# EAGLE design object_1 (EAGLE 9.0.0)
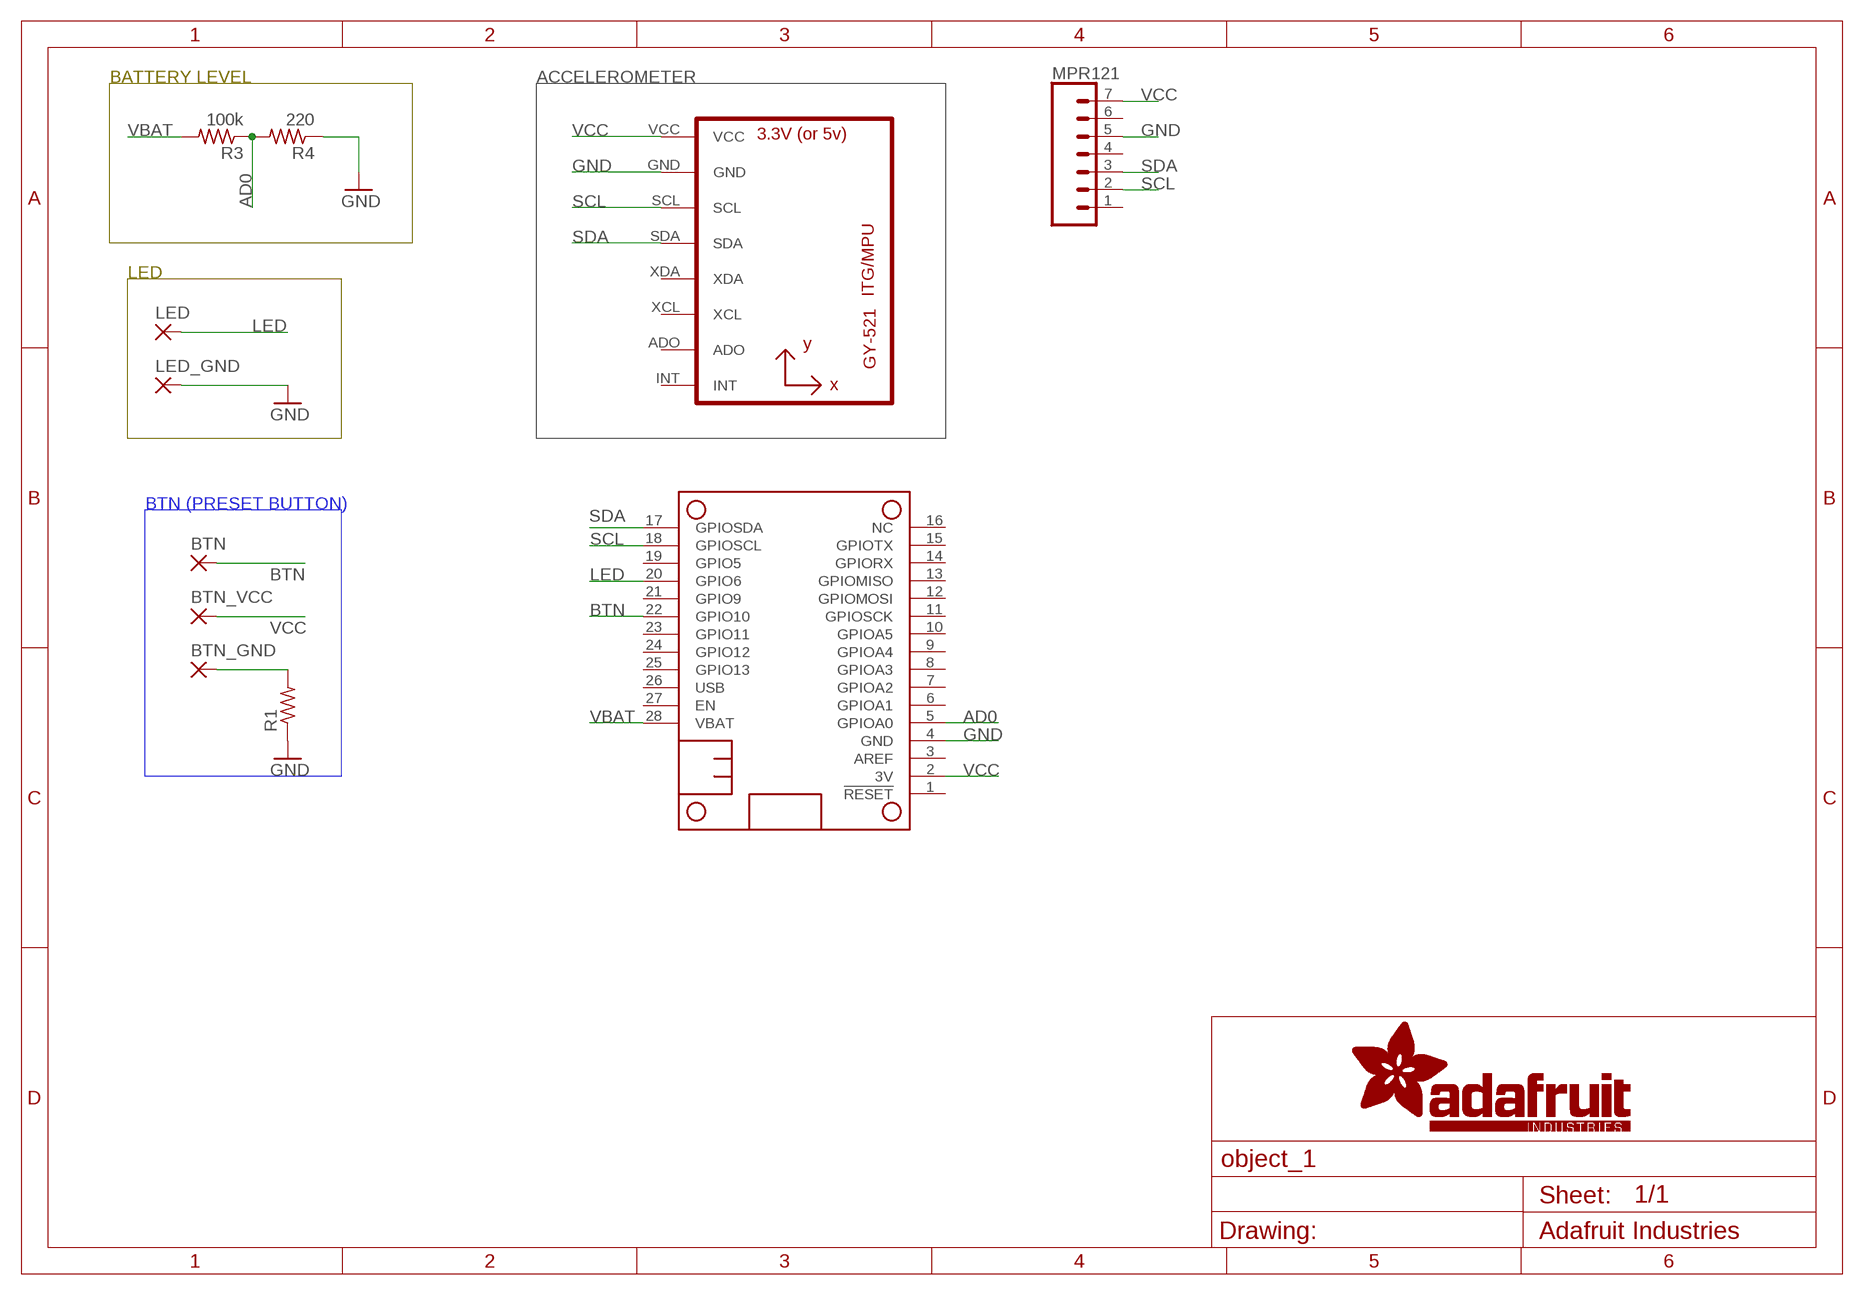
[diagram p0: schematic, sheet 1]

## Parts
BTN  2,15/1,0  [2,15/1,0]
BTN_GND  2,15/1,0  [2,15/1,0]
BTN_VCC  2,15/1,0  [2,15/1,0]
LED  2,15/1,0  [2,15/1,0]
LED_GND  2,15/1,0  [2,15/1,0]
MPR121  CONN_07NO_SILK  [1X07_NO_SILK]
MS1  FEATHERWING  [FEATHERWING]
R1  R-US_0204/5  [0204/5]
R3  100k  R-US_0204/5  [0204/5]
R4  220  R-US_0204/5  [0204/5]
U1  GY-521MPU6050  [GY-521]

## Nets
AD0: MS1.5(GPIOA0) R3.1 R4.2
BTN: BTN.1(P) MS1.22(GPIO10)
GND: LED_GND.1(P) MPR121.5 MS1.4(GND) R1.1 R4.1 U1.GND
GND_BTN: BTN_GND.1(P) R1.2
LED: LED.1(P) MS1.20(GPIO6)
SCL: MPR121.2 MS1.18(GPIOSCL) U1.SCL
SDA: MPR121.3 MS1.17(GPIOSDA) U1.SDA
VBAT: MS1.28(VBAT) R3.2
VCC: BTN_VCC.1(P) MPR121.7 MS1.2(3V) U1.VCC
Unconnected: MPR121.1 MPR121.4 MPR121.6 MS1.1(!RESET) MS1.3(AREF) MS1.6(GPIOA1) MS1.7(GPIOA2) MS1.8(GPIOA3) MS1.9(GPIOA4) MS1.10(GPIOA5) MS1.11(GPIOSCK) MS1.12(GPIOMOSI) MS1.13(GPIOMISO) MS1.14(GPIORX) MS1.15(GPIOTX) MS1.16(NC) MS1.19(GPIO5) MS1.21(GPIO9) MS1.23(GPIO11) MS1.24(GPIO12) MS1.25(GPIO13) MS1.26(USB) MS1.27(EN) U1.ADO U1.INT U1.XCL U1.XDA

## Notes on the sheet
- BATTERY LEVEL | ACCELEROMETER
- LED
- BTN (PRESET BUTTON)

## Library data of the parts
BTN BTN_GND BTN_VCC LED LED_GND = wirepad:2,15/1,0: THROUGH-HOLE PAD
MPR121 = SparkFun-Connectors:CONN_07: Multi connection point. Often used as Generic Header-pin footprint for 0.1 inch spaced/style header connections On any of the 0.1 inch spaced packages, you can populate with these: Break Away Headers - Straight <https://www.sparkfun.com/products/116> (PRT-00116) Break Away Male Headers - Right Angle <https://www.sparkfun.com/products/553> (PRT-00553) Female Headers <https://www.sparkfun.com/products/115> (PRT-00115) Break Away Headers - Machine Pin <https://www.sparkfun.com/products/117> (PRT-00117) Break Away Female Headers - Swiss Machine Pin <https://www.sparkfun.com/products/743> (PRT-00743) For SCREWTERMINALS and SPRING TERMINALS visit here: Screw Terimnals on SparkFun.com <https://www.sparkfun.com/search/results?term=Screw+Terminals> (5mm/3.5mm/2.54mm spacing) This device is also useful as a general connection point to wire up your design to another part of your project. Our various solder wires solder well into these plated through hole pads. Hook-Up Wire - Assortment (Stranded, 22 AWG) <https://www.sparkfun.com/products/11375> (PRT-11375) Hook-Up Wire - Assortment (Solid Core, 22 AWG) <https://www.sparkfun.com/products/11367> (PRT-11367) View the entire wire category on our website here <https://www.sparkfun.com/categories/141> Special notes: Molex polarized connector foot print use with SKU : PRT-08231 with associated crimp pins and housings. 1MM SMD Version SKU: PRT-10208 NOTES ON THE VARIANTS LOCK and LOCK_LONGPADS... This footprint was designed to help hold the alignment of a through-hole component (i.e. 6-pin header) while soldering it into place. You may notice that each hole has been shifted either up or down by 0.005 of an inch from it's more standard position (which is a perfectly straight line). This slight alteration caused the pins (the squares in the middle) to touch the edges of the holes. Because they are alternating, it causes a "brace" to hold the component in place. 0.005 has proven to be the perfect amount of "off-center" position when using our standard breakaway headers. Although looks a little odd when you look at the bare footprint, once you have a header in there, the alteration is very hard to notice. Also,if you push a header all the way into place, it is covered up entirely on the bottom side.
MS1 = microbuilder:FEATHERWING
R1 R3 R4 = resistor:R-US_: RESISTOR, American symbol
U1 = gy-521:GY-521

## Board
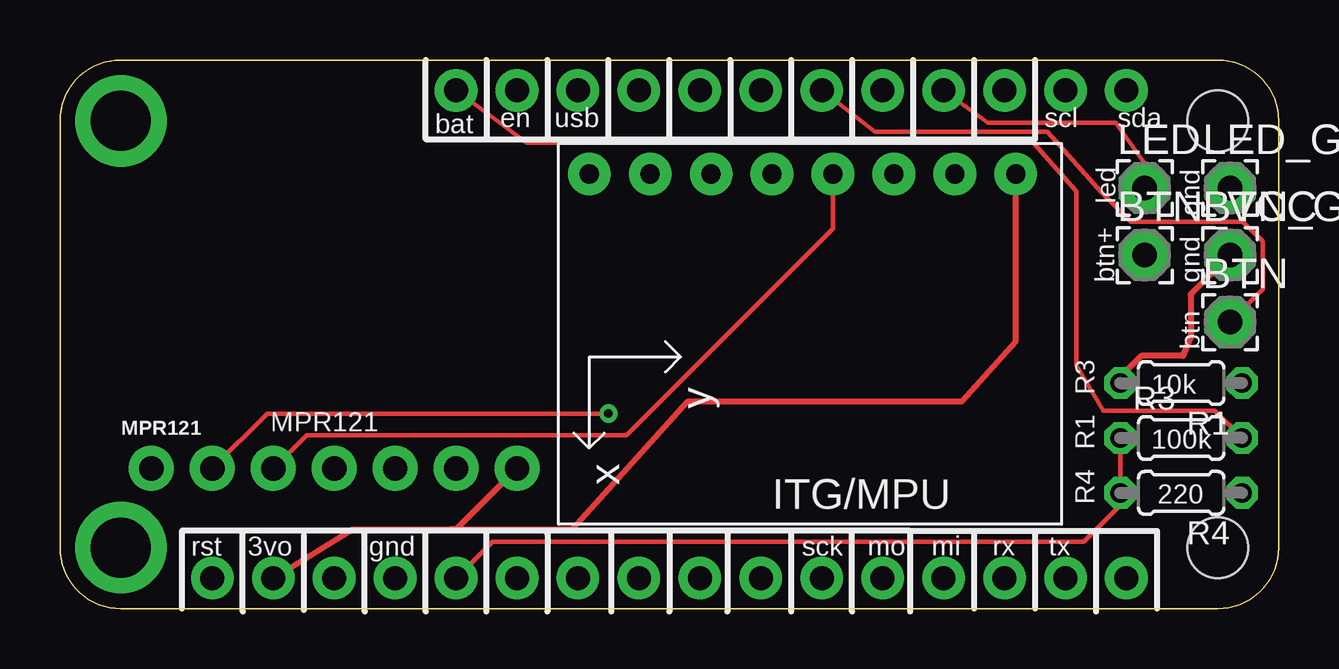
[diagram p1: board, top side]
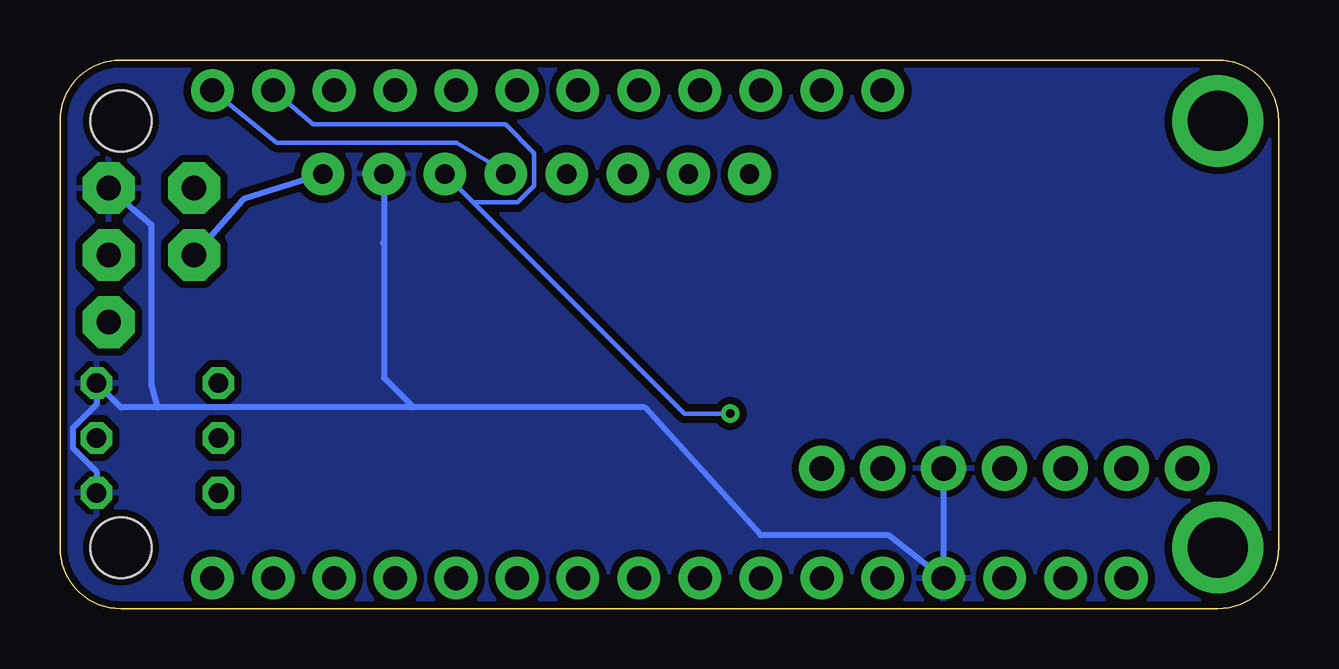
[diagram p2: board, bottom side, seen from below]

Size 50.8 x 22.86 mm. Coordinates in mm from the lower left corner, seen from the top.
Outline: 2.54,22.86 48.26,22.86 arc-90 50.8,20.32 50.8,2.54 arc-90 48.26,0 2.54,0 arc-90 0,2.54 0,20.32 arc-90 2.54,22.86
Copper layers (1*16): Top 0.035mm / dielectric 1.5mm / Bottom 0.035mm
Design rules "adafruit *": minimum track width 7mil, minimum drill 0.3mm, track to track 8mil, track to pad 8mil, pad to pad 8mil, via to via 8mil, smd to smd 8mil, copper to edge 10mil, drill to drill 8mil, minimum pad ring 10mil, minimum via ring 8mil, stop-mask expansion 2mil, vias tented up to drill 20mil, thermal gap 10mil

### Footprints (pad centres in the part's own frame; a part is rotated, then mirrored left to right if it is on the bottom)
2,15/1,0 = drill 1.016 pad 2.159 octagon: 1 0,0
1X07_NO_SILK = drill 1.016 pad 1.88: 1 0,0; 2 2.54,0; 3 5.08,0; 4 7.62,0; 5 10.16,0; 6 12.7,0; 7 15.24,0
FEATHERWING = drill 1 pad 1.778: 1 6.35,1.27; 2 8.89,1.27; 3 11.43,1.27; 4 13.97,1.27; 5 16.51,1.27; 6 19.05,1.27; 7 21.59,1.27; 8 24.13,1.27; 9 26.67,1.27; 10 29.21,1.27; 11 31.75,1.27; 12 34.29,1.27; 13 36.83,1.27; 14 39.37,1.27; 15 41.91,1.27; 16 44.45,1.27; 17 44.45,21.59; 18 41.91,21.59; 19 39.37,21.59; 20 36.83,21.59; 21 34.29,21.59; 22 31.75,21.59; 23 29.21,21.59; 24 26.67,21.59; 25 24.13,21.59; 26 21.59,21.59; 27 19.05,21.59; 28 16.51,21.59 | drill 2.5 pad 3.81: P$1 2.54,20.32; P$2 2.54,2.54 | hole 2.54: 48.26,20.32; 48.26,2.54
0204/5 = drill 0.813 octagon: 1 -2.54,0; 2 2.54,0
GY-521 = drill 0.8 pad 1.778: ADO -10.16,-6.35; GND -10.16,6.35; INT -10.16,-8.89; SCL -10.16,3.81; SDA -10.16,1.27; VCC -10.16,8.89; XCL -10.16,-3.81; XDA -10.16,-1.27

### Placement (x,y rotation side)
BTN  48.77,11.94 0 top
BTN_GND  48.77,14.73 0 top
BTN_VCC  45.21,14.73 0 top
LED  45.21,17.53 0 top
LED_GND  48.77,17.53 0 top
MPR121  3.81,5.84 0 top
MS1  0,0 0 top
R1  46.74,9.4 180 top
R3  46.74,7.11 0 top
R4  46.74,4.83 180 top
U1  30.95,7.95 270 top

### Tracks (layer width: path | path; a pad name or v marks a point on that pad's centre or on a via)
AD0
  Top 0.178: R3.1 R4.2 44.2,4.32 42.67,2.79 18.03,2.79 MS1.5
BTN
  Top 0.178: MS1.22 33.97,19.87 41.15,19.87 43.43,17.33 44.64,16.13 49.31,16.13 50.14,15.3 50.14,13.31 BTN.1
GND
  Bottom 0.254: 36.07,8.38 26.42,8.38 21.59,3.05 16.26,3.05 MS1.4 MPR121.5 | 36.07,8.38 46.74,8.38 | 46.74,8.38 48.26,8.38 R1.1 49.28,8.51 50.27,7.52 50.27,6.7 49.28,5.71 R4.1 | 46.74,8.38 46.99,9.4 46.99,16 LED_GND.1 | 37.34,15.24 37.3,15.28 U1.GND 37.3,9.61 36.07,8.38
  pour Bottom (isolate 0.305): 0,22.86 0,0 50.8,0 50.8,22.86
GND_BTN
  Top 0.254: R1.2 44.2,9.65 45.07,10.53 46.81,10.53 47.13,11.35 47.13,13.09 BTN_GND.1
LED
  Top 0.178: MS1.20 38.67,20.25 44.01,20.25 45.21,18.54 LED.1
SCL  (via drill 0.35)
  Top 0.178: MPR121.2 8.64,8.13 v22.86,8.13
  Bottom 0.178: MS1.18 40.25,20.18 32.24,20.18 31.04,18.98 31.04,17.62 31.73,16.93 33.58,16.93 U1.SCL 24.77,8.13 v22.86,8.13
SDA
  Top 0.178: MPR121.3 10.27,7.23 23.62,7.23 31.99,15.6 32.22,15.83 U1.SDA
  Bottom 0.178: MS1.17 41.77,19.42 34.27,19.42 32.98,18.64 U1.SDA
VBAT
  Top 0.178: R3.2 48.13,8.26 43.48,8.26 42.37,10.13 42.37,17.38 40.58,19.42 19.44,19.42 MS1.28
VCC
  Top 0.254: MS1.2 12.19,3.3 16.26,3.3 16.51,3.3 | 16.51,3.3 21.34,3.3 26.16,8.64 37.59,8.64 39.84,11.14 U1.VCC | MPR121.7 16.51,3.3
  Bottom 0.254: BTN_VCC.1 43.18,17.02 43.1,17.1 U1.VCC

### Text on the board
tPlace: bat | en | usb | scl | sda | led | gnd | btn+ | gnd | btn | R3 | 10k | MPR121 | R1 | 100k | R4 | 220 | rst | 3vo | gnd | sck | mo | mi | rx | tx